# EAGLE schematic clockBot_userInterface (EAGLE 9.5.1)
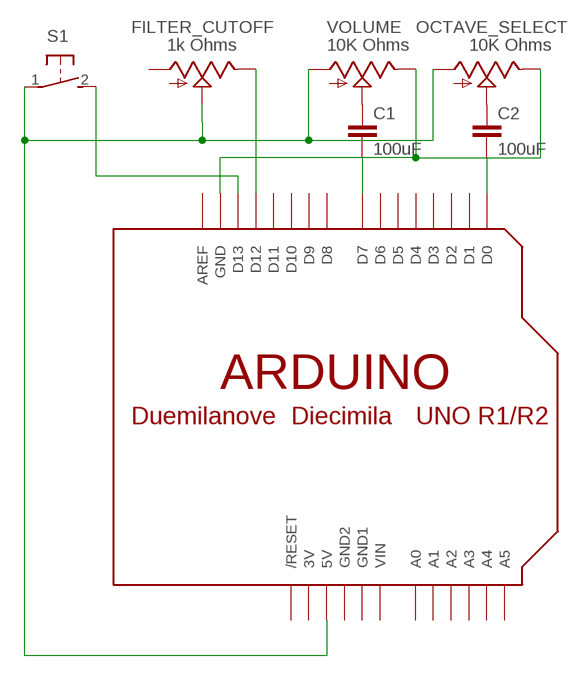
[diagram p0: schematic, sheet 1]

## Parts
C1  100uF  C5/2.5  [C5B2.5]
C2  100uF  C5/2.5  [C5B2.5]
FILTER_CUTOFF  1k Ohms  TRIM_US-S64W  [S64W]
OCTAVE_SELECT  10K Ohms  TRIM_US-S64W  [S64W]
S1  31-XX  [B3F-31XX]
U$1  ARDUINO-NODIM  [ARDUINO-NODIM]
VOLUME  10K Ohms  TRIM_US-S64W  [S64W]

## Nets
N$1: FILTER_CUTOFF.S OCTAVE_SELECT.A S1.1(P) U$1.5V VOLUME.A
N$2: S1.2(S) U$1.D13
N$3: FILTER_CUTOFF.E U$1.D12
N$6: C2.1 OCTAVE_SELECT.S
N$7: C1.1 VOLUME.S
N$8: C2.2 U$1.D0
N$9: OCTAVE_SELECT.E U$1.GND VOLUME.E
N$10: C1.2 U$1.D7
Unconnected: FILTER_CUTOFF.A U$1.A0 U$1.A1 U$1.A2 U$1.A3 U$1.A4 U$1.A5 U$1.AREF U$1.D1 U$1.D2 U$1.D3 U$1.D4 U$1.D5 U$1.D6 U$1.D8 U$1.D9 U$1.D10 U$1.D11 U$1.RESET(/RESET)

## Power pins joined to a net without a drawn wire
3V: U$1.3V
GND1: U$1.GND1
GND2: U$1.GND2
VIN: U$1.VIN

## Library data of the parts
C1 C2 = capacitor-wima:C: CAPACITOR naming: grid - package width
FILTER_CUTOFF OCTAVE_SELECT VOLUME = pot:TRIM_US-: POTENTIOMETER
S1 = adafruit:31-XX: OMRON SWITCH Now with beefier pads!
U$1 = adafruit:ARDUINO: Arduino Diecimila/Duemilanove Make a shield with ease, this package has all the named pins as well as the two mounting drill holes and an outline of the USB and DC power connector. The outline is on the DIMENSION layer, so if your board house uses it they will cut the outline to match. http://www.ladyada.net/library/pcb/eaglelibrary.html